# EAGLE design Fuse_protector (EAGLE 7.3.0)
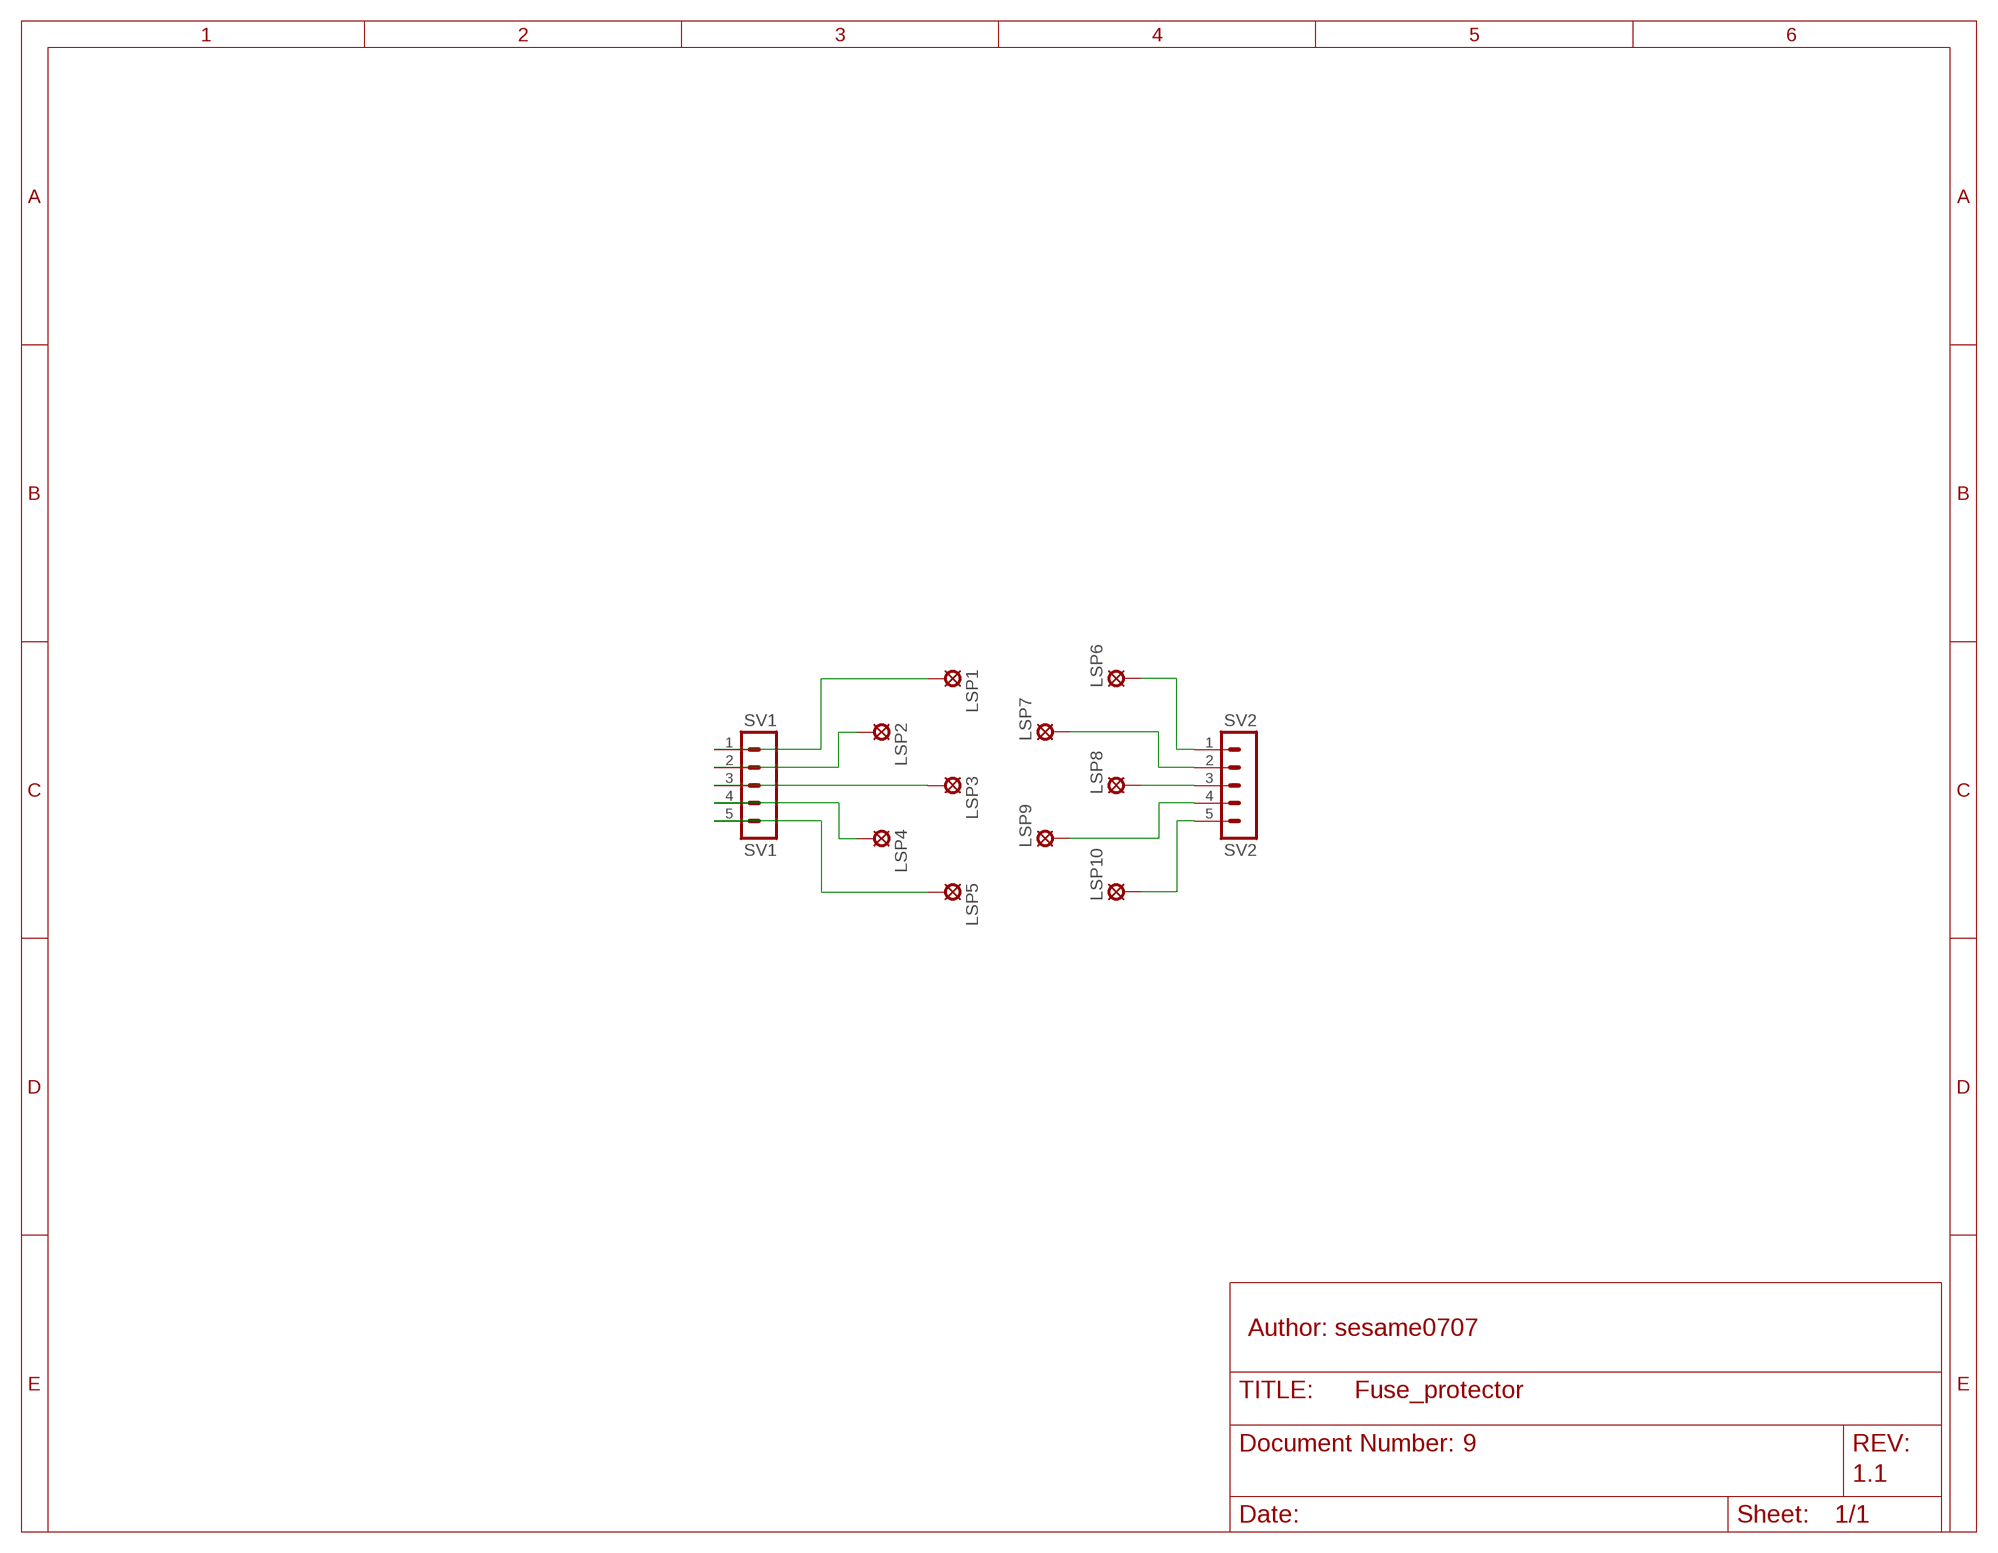
[diagram p0: schematic, sheet 1]

## Parts
LSP1  SE14  [SE14]
LSP2  SE14  [SE14]
LSP3  SE14  [SE14]
LSP4  SE14  [SE14]
LSP5  SE14  [SE14]
LSP6  SE14  [SE14]
LSP7  SE14  [SE14]
LSP8  SE14  [SE14]
LSP9  SE14  [SE14]
LSP10  SE14  [SE14]
SV1  SV1  MA05-1  [MA05-1]
SV2  SV2  MA05-1  [MA05-1]

## Nets
N$1: LSP1.MP SV1.1
N$2: LSP2.MP SV1.2
N$3: LSP3.MP SV1.3
N$4: LSP4.MP SV1.4
N$5: LSP5.MP SV1.5
N$6: LSP6.MP SV2.1
N$7: LSP7.MP SV2.2
N$8: LSP8.MP SV2.3
N$9: LSP9.MP SV2.4
N$10: LSP10.MP SV2.5

## Notes on the sheet
- Author: sesame0707
- 9
- 1.1

## Library data of the parts
LSP1-LSP10 = solpad:SE14: SOLDER PAD E1553, drill 1,4mm, distributor Buerklin, 07F820
SV1 SV2 = con-lstb:MA05-1: PIN HEADER; OC_FARNELL: unknown; OC_NEWARK: unknown

## Board
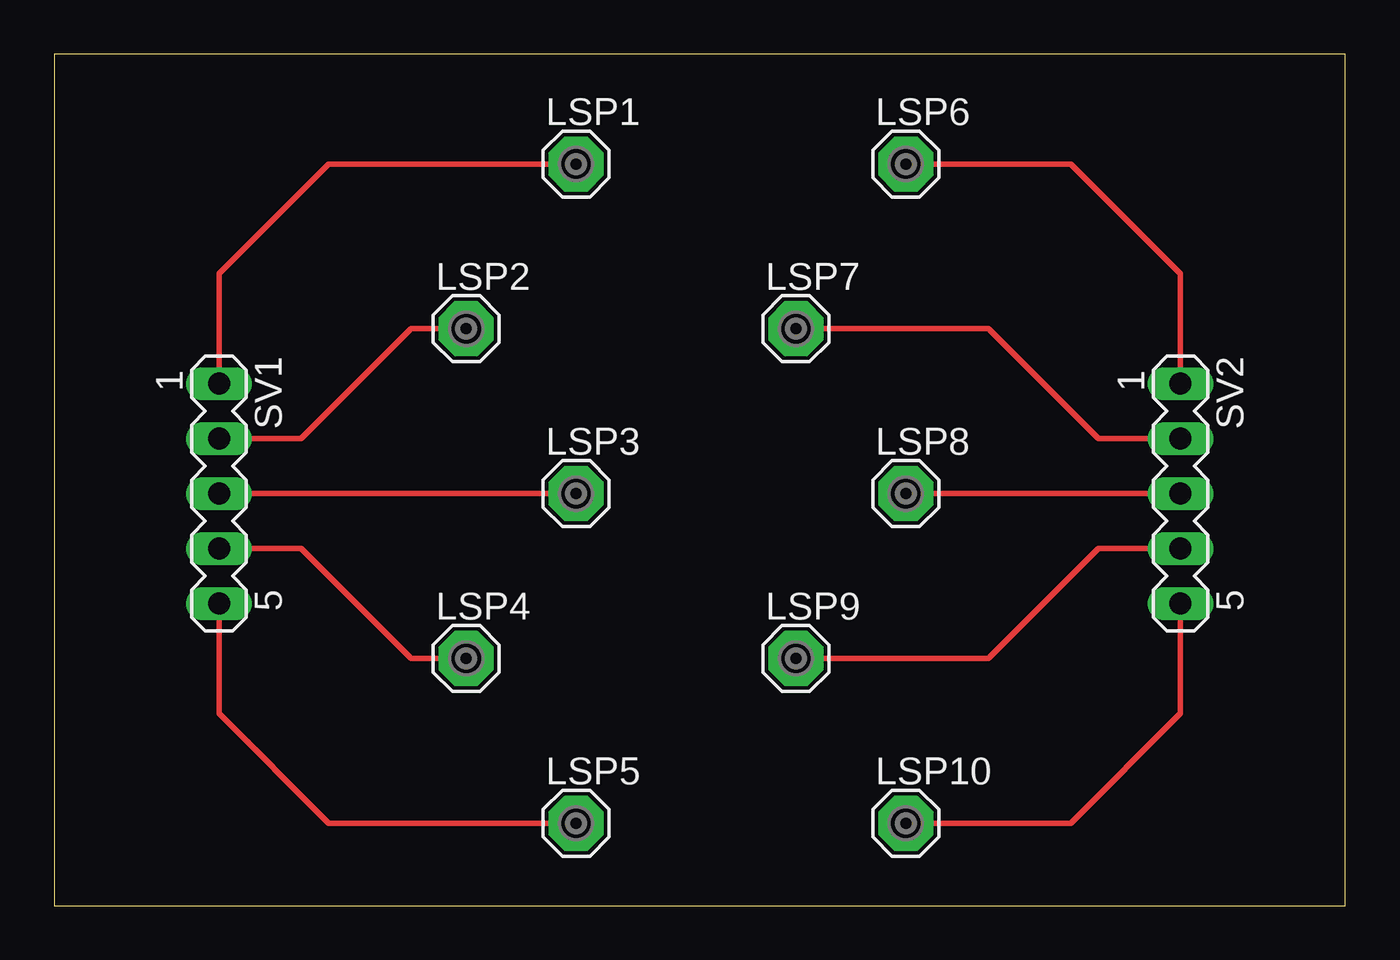
[diagram p1: board, top side]

Size 59.69 x 39.37 mm. Coordinates in mm from the lower left corner, seen from the top.
Outline: 0,0 59.69,0 59.69,39.37 0,39.37 0,0
Copper layers (1*16): Top 0.035mm / dielectric 1.5mm / Bottom 0.035mm
Design rules "default": minimum track width 10mil, minimum drill 24mil, track to track 8mil, track to pad 8mil, pad to pad 8mil, via to via 8mil, smd to smd 8mil, copper to edge 40mil, drill to drill 8mil, minimum pad ring 10mil, minimum via ring 8mil, stop-mask expansion 4mil, vias tented up to drill 0mil, thermal gap 10mil

### Footprints (pad centres in the part's own frame; a part is rotated, then mirrored left to right if it is on the bottom)
SE14 = drill 1.397 pad 2.54 octagon: MP 0,0
MA05-1 = drill 1.016 long: 1 -5.08,0; 2 -2.54,0; 3 0,0; 4 2.54,0; 5 5.08,0

### Placement (x,y rotation side)
LSP1  24.13,34.29 0 top
LSP2  19.05,26.67 0 top
LSP3  24.13,19.05 0 top
LSP4  19.05,11.43 0 top
LSP5  24.13,3.81 0 top
LSP6  39.37,34.29 0 top
LSP7  34.29,26.67 0 top
LSP8  39.37,19.05 0 top
LSP9  34.29,11.43 0 top
LSP10  39.37,3.81 0 top
SV1  7.62,19.05 270 top
SV2  52.07,19.05 270 top

### Tracks (layer width: path | path; a pad name or v marks a point on that pad's centre or on a via)
N$1
  Top 0.254: SV1.1 7.62,29.21 12.7,34.29 LSP1.MP
N$2
  Top 0.254: SV1.2 11.43,21.59 16.51,26.67 LSP2.MP
N$3
  Top 0.254: SV1.3 LSP3.MP
N$4
  Top 0.254: SV1.4 11.43,16.51 16.51,11.43 LSP4.MP
N$5
  Top 0.254: SV1.5 7.62,8.89 12.7,3.81 LSP5.MP
N$6
  Top 0.254: SV2.1 52.07,29.21 46.99,34.29 LSP6.MP
N$7
  Top 0.254: SV2.2 48.26,21.59 43.18,26.67 LSP7.MP
N$8
  Top 0.254: SV2.3 LSP8.MP
N$9
  Top 0.254: SV2.4 48.26,16.51 43.18,11.43 LSP9.MP
N$10
  Top 0.254: SV2.5 52.07,8.89 46.99,3.81 LSP10.MP